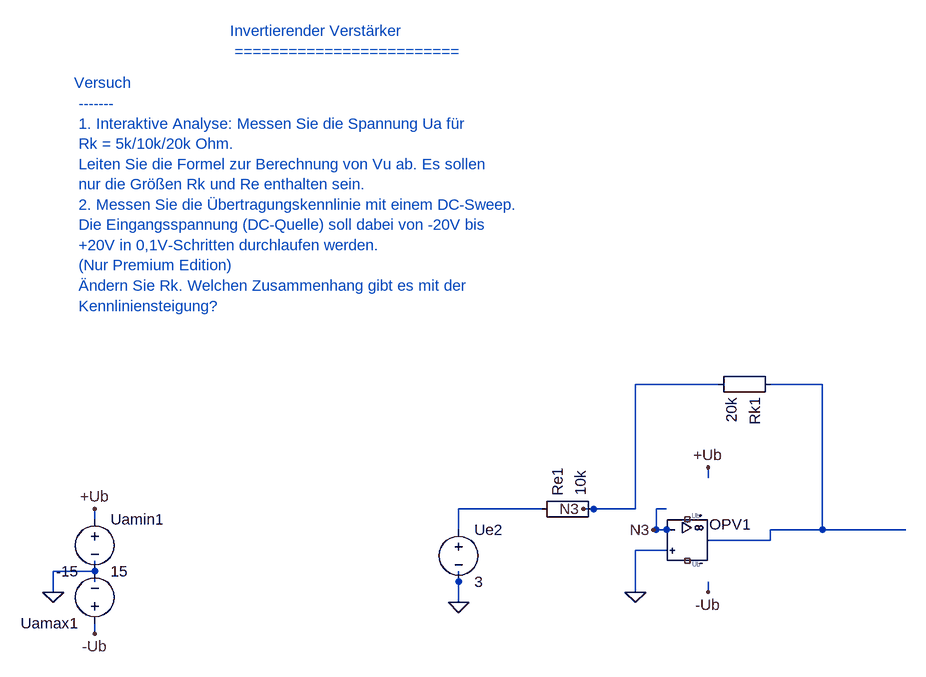
[diagram p0: schematic 1_2_3_Invertierender_Verstärker.asc]
1_2_3_Invertierender_Verstärker.asc, the LTspice schematic file:
Version 4
SHEET 1 880 680
WIRE 1008 832 992 832
WIRE 992 832 992 800
WIRE 992 800 1008 800
WIRE 1072 848 1168 848
WIRE 1168 848 1168 832
WIRE 128 896 128 880
WIRE 128 896 128 912
WIRE 688 912 688 896
WIRE 128 816 128 800
WIRE 1072 736 1072 752
WIRE 1072 928 1072 912
WIRE 1376 832 1248 832
WIRE 688 896 688 944
WIRE 1248 832 1168 832
WIRE 1168 608 1248 608
WIRE 1248 608 1248 832
WIRE 688 832 688 800
WIRE 688 800 816 800
WIRE 896 800 960 800
WIRE 1088 608 960 608
WIRE 960 608 960 800
WIRE 960 928 960 864
WIRE 960 864 1008 864
WIRE 128 896 64 896
WIRE 64 896 64 928
WIRE 128 976 128 992
WIRE 896 800 880 800
WIRE 1008 832 988 832
FLAG 688 944 0
FLAG 64 928 0
FLAG 960 928 0
FLAG 64 928 0
FLAG 688 944 0
FLAG 960 928 0
FLAG 880 800 N3
FLAG 988 832 N3
FLAG 128 800 +Ub
FLAG 1072 736 +Ub
FLAG 128 992 -Ub
FLAG 1072 928 -Ub
SYMBOL UniversalOpAmp2 1040 848 R0
SYMATTR InstName OPV1
SYMATTR Value UniversalOpAmp2
SYMBOL voltage 128 800 R0
SYMATTR InstName Uamin1
SYMATTR Value 15
SYMBOL voltage 128 992 R180
SYMATTR InstName Uamax1
SYMATTR Value -15
SYMBOL voltage 688 816 R0
SYMATTR InstName Ue2
SYMATTR Value 3
SYMBOL Misc\EuropeanResistor 1184 592 R90
SYMATTR InstName Rk1
SYMATTR Value 20k
SYMBOL Misc\EuropeanResistor 800 816 R270
SYMATTR InstName Re1
SYMATTR Value 10k
TEXT 336 64 Left 2 ;Invertierender Verstärker \n =========================
TEXT 96 144 Left 2 ;Versuch \n ------- \n 1. Interaktive Analyse: Messen Sie die Spannung Ua für \n Rk = 5k/10k/20k Ohm. \n Leiten Sie die Formel zur Berechnung von Vu ab. Es sollen \n nur die Größen Rk und Re enthalten sein. \n 2. Messen Sie die Übertragungskennlinie mit einem DC-Sweep. \n Die Eingangsspannung (DC-Quelle) soll dabei von -20V bis \n +20V in 0,1V-Schritten durchlaufen werden. \n (Nur Premium Edition) \n Ändern Sie Rk. Welchen Zusammenhang gibt es mit der \n Kennliniensteigung?

The netlist it stands for:
* 1_2_3_Invertierender_Verstärker.asc
XOPV1 0 N3 NC_01 NC_02 N001 level2 UniversalOpAmp2 Avol=1Meg GBW=10Meg Slew=10Meg Ilimit=25m Rail=0 Vos=0 En=0 Enk=0 In=0 Ink=0 Rin=500Meg  ; pins In+ In- V+ V- OUT
V§Uamin1 +Ub 0 15
V§Uamax1 -Ub 0 -15
V§Ue2 N002 0 3
Rk1 N001 N3 20k
Re1 N002 N3 10k
* Invertierender Verstärker
*  =========================
* Versuch
*  -------
*  1. Interaktive Analyse: Messen Sie die Spannung Ua für
*  Rk = 5k/10k/20k Ohm.
*  Leiten Sie die Formel zur Berechnung von Vu ab. Es sollen
*  nur die Größen Rk und Re enthalten sein.
*  2. Messen Sie die Übertragungskennlinie mit einem DC-Sweep.
*  Die Eingangsspannung (DC-Quelle) soll dabei von -20V bis
*  +20V in 0,1V-Schritten durchlaufen werden.
*  (Nur Premium Edition)
*  Ändern Sie Rk. Welchen Zusammenhang gibt es mit der
*  Kennliniensteigung?
.lib UniversalOpAmp2.lib
.backanno
.end